# EAGLE schematic u-aizu_pir (EAGLE 8.2.2)
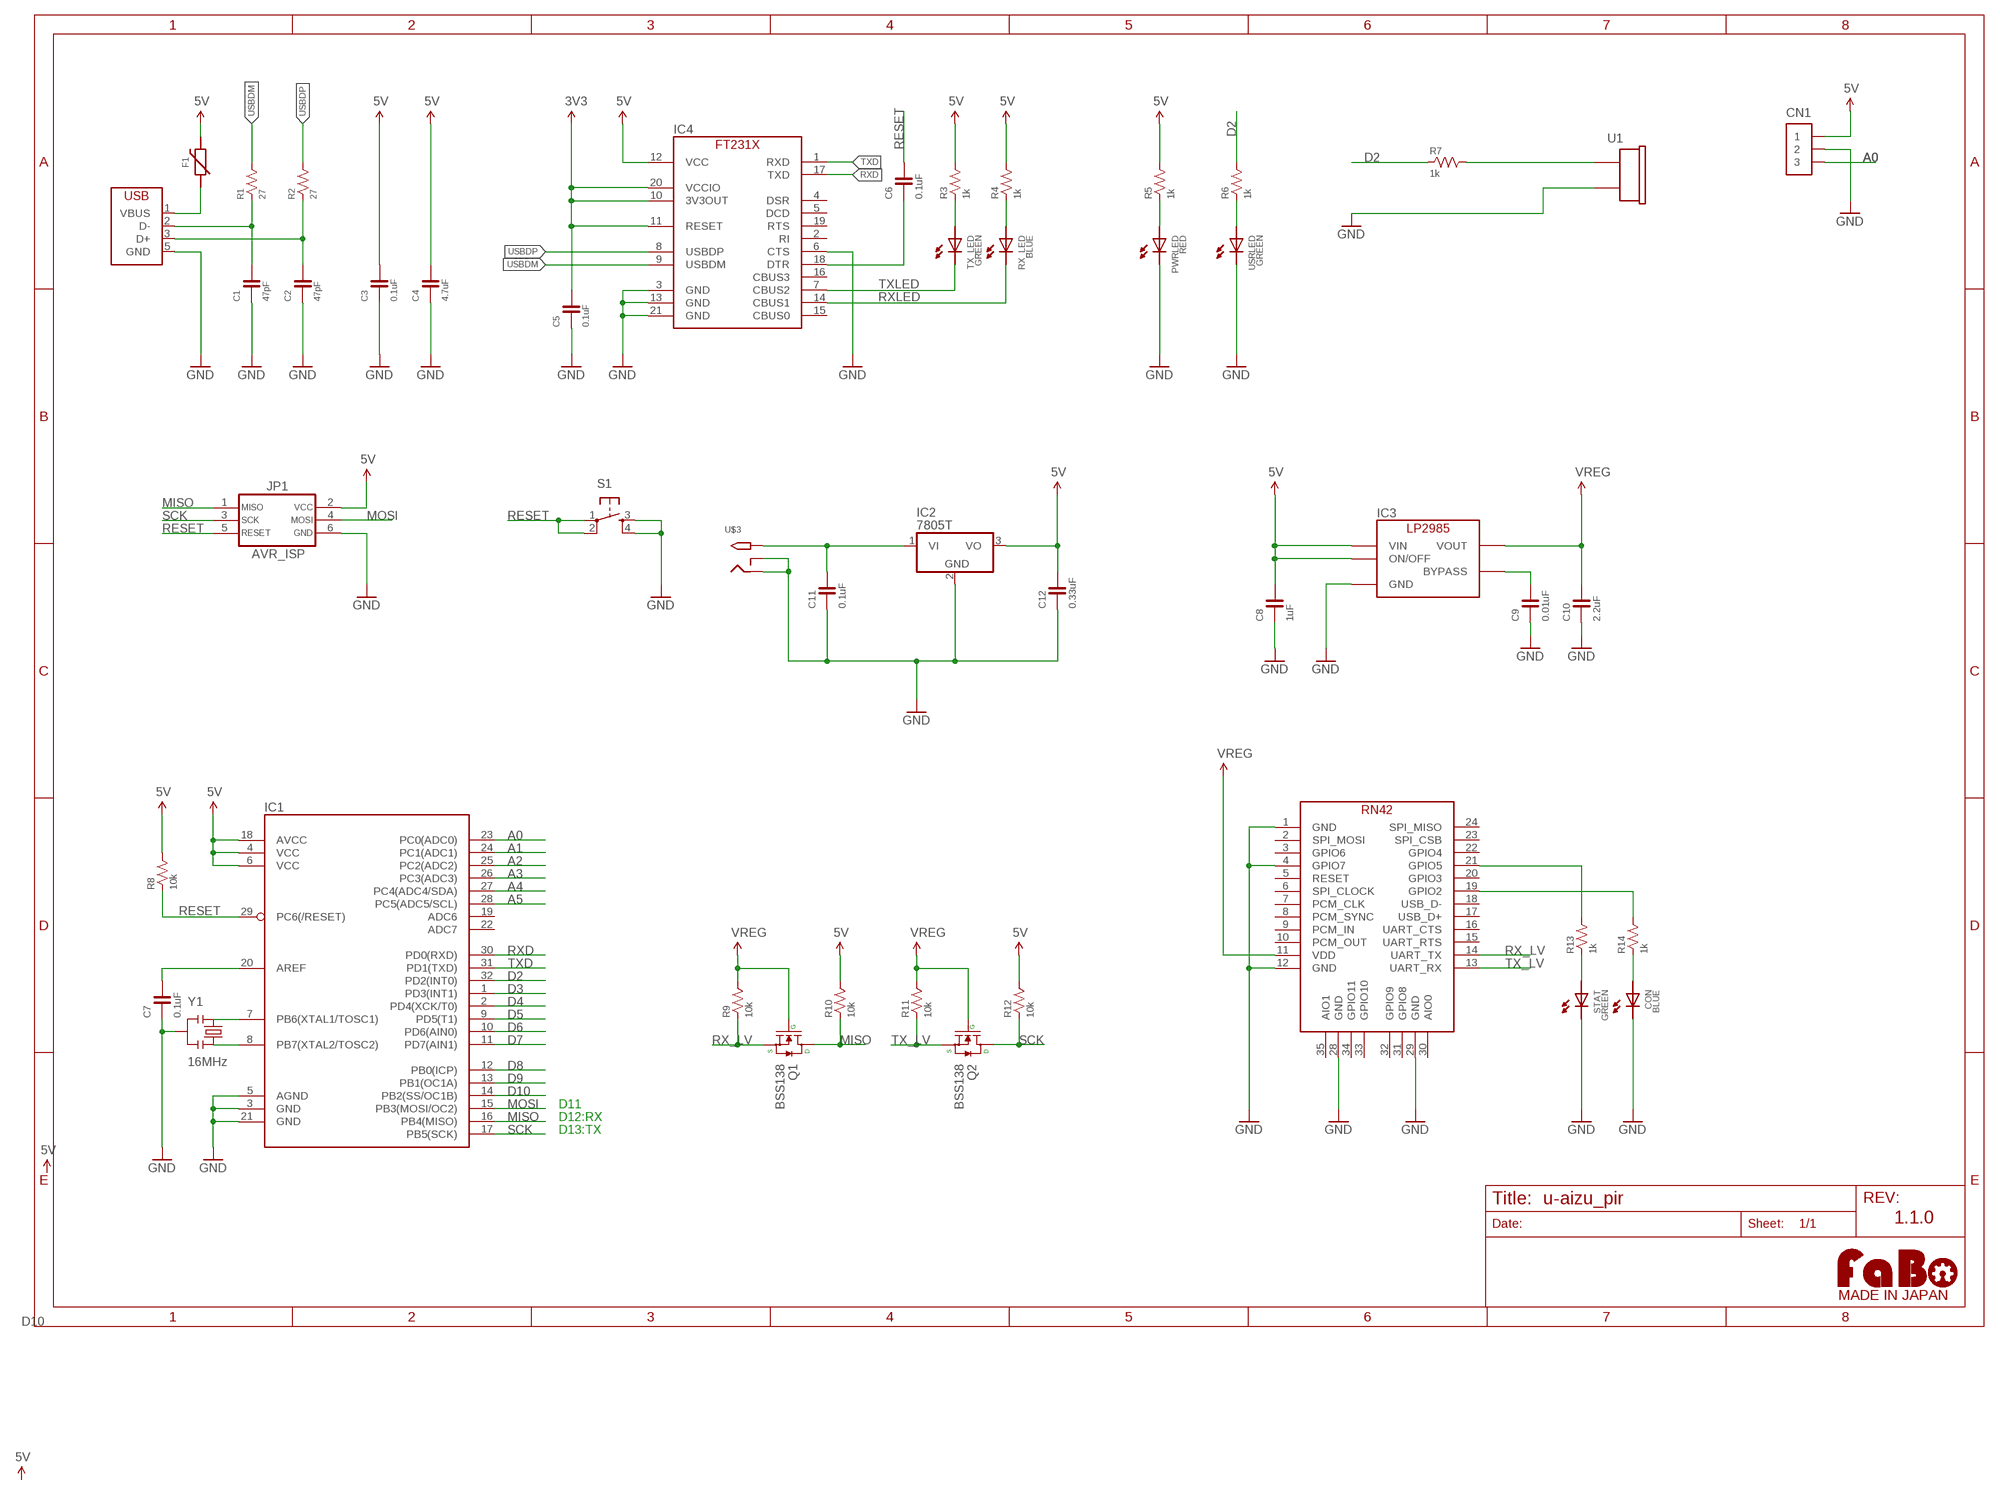
[diagram p0: schematic, sheet 1]

## Parts
C1  47pF  CAPACITOR-0603  [EIA0603]
C2  47pF  CAPACITOR-0603  [EIA0603]
C3  0.1uF  CAPACITOR-0603  [EIA0603]
C4  4.7uF  CAPACITOR-0603  [EIA0603]
C5  0.1uF  CAPACITOR-0603  [EIA0603]
C6  0.1uF  CAPACITOR-0603  [0603]
C7  0.1uF  CAPACITOR-0603  [0603]
C8  1uF  CAPACITOR-0603  [0603]
C9  0.01uF  CAPACITOR-0603  [0603]
C10  2.2uF  CAPACITOR-0603  [0603]
C11  0.1uF  CAPACITOR-0603  [0603]
C12  0.33uF  CAPACITOR-0603  [0603]
CN1  PIN_HEADER_1X3  [PIN_1X3]
CON  BLUE  LED-0603  [0603]
F1  FUSE-NANO  [NANOSMDC035F]
IC1  ATMEGA328P-AU  [TQFP-32]
IC2  7805T  [TO220H]
IC3  LP2985-33DBV  [SOT-23-5]
IC4  FT231XQ  [QFN-20_FT231X]
JP1  AVR_ISP  AVR_ISP-TC2030_NOHOLE  [TC2030]
PWRLED  RED  LED-0603  [0603]
Q1  BSS138  MOSFET-N  [SOT23-3]
Q2  BSS138  MOSFET-N  [SOT23-3]
R1  27  RESISTOR-0603  [EIA0603]
R2  27  RESISTOR-0603  [EIA0603]
R3  1k  RESISTOR-0603  [0603]
R4  1k  RESISTOR-0603  [0603]
R5  1k  RESISTOR-0603  [0603]
R6  1k  RESISTOR-0603  [0603]
R7  1k  RESISTOR-AXL-REGULAR  [AXL-REGULAR]
R8  10k  RESISTOR-0603  [0603]
R9  10k  RESISTOR-0603  [0603]
R10  10k  RESISTOR-0603  [0603]
R11  10k  RESISTOR-0603  [0603]
R12  10k  RESISTOR-0603  [0603]
R13  1k  RESISTOR-0603  [0603]
R14  1k  RESISTOR-0603  [0603]
RX_LED  BLUE  LED-0603  [0603]
S1  TACT-SWITCH-SMD_KMR2  [KMR2]
STAT  GREEN  LED-0603  [0603]
TX_LED  GREEN  LED-0603  [0603]
U1  BUZZER  [PKM13EPYH4000-A0]
U$2  LOGO_FABO-S_BOTTOM  [LOGO_FABO_S_BOTTOM]
U$3  2.1MMJACKTHM  [PJ-102A]
U$4  MICROCHIP-RN42  [MICROCHIP-RN42]
USB1  USB-MICRO_B_SMT_HIROSE  [ZX62R-B-5P]
USRLED  GREEN  LED-0603  [0603]
Y1  16MHz  RESONATOR-CSTCE_V  [CSTCE_V]

## Nets
3V3: C5.2 IC4.10(3V3OUT) IC4.11(RESET) IC4.20(VCCIO)
5V: C3.2 C4.2 C8.2 C12.2 CN1.1 F1.2 IC1.4(VCC) IC1.6(VCC) IC1.18(AVCC) IC2.3(VO) IC3.1(VIN) IC3.3(ON/OFF) IC4.12(VCC) JP1.2 R3.2 R4.2 R5.2 R8.2 R10.2 R12.2
A0: CN1.3 IC1.23(PC0(ADC0))
A1: IC1.24(PC1(ADC1))
A2: IC1.25(PC2(ADC2))
A3: IC1.26(PC3(ADC3))
A4: IC1.27(PC4(ADC4/SDA))
A5: IC1.28(PC5(ADC5/SCL))
D2: IC1.32(PD2(INT0)) R6.2 R7.1
D3: IC1.1(PD3(INT1))
D4: IC1.2(PD4(XCK/T0))
D5: IC1.9(PD5(T1))
D6: IC1.10(PD6(AIN0))
D7: IC1.11(PD7(AIN1))
D8: IC1.12(PB0(ICP))
D9: IC1.13(PB1(OC1A))
D10: IC1.14(PB2(SS/OC1B))
DM: C2.2 R2.1 USB1.3(D+)
DP: C1.2 R1.1 USB1.2(D-)
DTR: C6.1 IC4.18(DTR)
GND: C1.1 C2.1 C3.1 C4.1 C5.1 C7.1 C8.1 C9.1 C10.1 C12.1 CN1.2 CON.CATHODE IC1.3(GND) IC1.5(AGND) IC1.21(GND) IC2.2(GND) IC3.2(GND) IC4.3(GND) IC4.6(CTS) IC4.13(GND) IC4.21(GND) JP1.6 PWRLED.CATHODE S1.3 S1.4 STAT.CATHODE U$3.RING U$3.RING_SW U$4.1(GND) U$4.4(GPIO7) U$4.12(GND) U$4.28(GND) U$4.29(GND) USB1.5(GND) USRLED.CATHODE Y1.2
GND1: U1.2
MISO: IC1.16(PB4(MISO)) JP1.1 Q1.3(D) R10.1
MOSI: IC1.15(PB3(MOSI/OC2)) JP1.4
N$1: R3.1 TX_LED.ANODE
N$2: C7.2 IC1.20(AREF)
N$3: IC1.8(PB7(XTAL2/TOSC2)) Y1.3
N$4: IC1.7(PB6(XTAL1/TOSC1)) Y1.1
N$5: C9.2 IC3.4(BYPASS)
N$6: F1.1 USB1.1(VBUS)
N$7: R4.1 RX_LED.ANODE
N$8: R13.2 U$4.21(GPIO5)
N$9: R14.2 U$4.19(GPIO2)
N$10: R13.1 STAT.ANODE
N$11: CON.ANODE R14.1
N$13: PWRLED.ANODE R5.1
N$14: R7.2 U1.1
N$15: R6.1 USRLED.ANODE
N$32: IC2.1(VI) U$3.TIP
RESET: C6.2 IC1.29(PC6(/RESET)) JP1.5 R8.1 S1.1 S1.2
RX_LV: Q1.2(S) R9.1 U$4.14(UART_TX)
RXD: IC1.30(PD0(RXD)) IC4.17(TXD)
RXLED: IC4.14(CBUS1) RX_LED.CATHODE
SCK: IC1.17(PB5(SCK)) JP1.3 Q2.3(D) R12.1
TX_LV: Q2.2(S) R11.1 U$4.13(UART_RX)
TXD: IC1.31(PD1(TXD)) IC4.1(RXD)
TXLED: IC4.7(CBUS2) TX_LED.CATHODE
USBDM: IC4.9(USBDM) R1.2
USBDP: IC4.8(USBDP) R2.2
VREG: C10.2 IC3.5(VOUT) Q1.1(G) Q2.1(G) R9.2 R11.2 U$4.11(VDD)
Unconnected: C11.1 C11.2 IC1.19(ADC6) IC1.22(ADC7) IC4.2(RI) IC4.4(DSR) IC4.5(DCD) IC4.15(CBUS0) IC4.16(CBUS3) IC4.19(RTS) U$4.2(SPI_MOSI) U$4.3(GPIO6) U$4.5(RESET) U$4.6(SPI_CLOCK) U$4.7(PCM_CLK) U$4.8(PCM_SYNC) U$4.9(PCM_IN) U$4.10(PCM_OUT) U$4.15(UART_RTS) U$4.16(UART_CTS) U$4.17(USB_D+) U$4.18(USB_D-) U$4.20(GPIO3) U$4.22(GPIO4) U$4.23(SPI_CSB) U$4.24(SPI_MISO) U$4.30(AIO0) U$4.31(GPIO8) U$4.32(GPIO9) U$4.33(GPIO10) U$4.34(GPIO11) U$4.35(AIO1)

## Notes on the sheet
- D11
- D12:RX
- D13:TX
- 1.1.0

## Library data of the parts
C1-C5 = u-aizu:CAPACITOR
C6-C12 = FaBo-Capacitor:CAPACITOR: CAPACITOR
CN1 = FaBo-PIN:PIN_HEADER_1X3
CON PWRLED RX_LED STAT TX_LED USRLED = FaBo-LED:LED
F1 = u-aizu:FUSE
IC1 = FaBo-MPU:ATMEGA328
IC2 = adafruit:78*: Positive VOLTAGE REGULATOR Added bigger pads to the TO-92 package
IC3 = FaBo-Supply:LP2985: LP2985
IC4 = u-aizu:FT231X
JP1 = FaBo-PIN:AVR_ISP
Q1 Q2 = FaBo-etc:MOSFET-N
R1 R2 = u-aizu:RESISTOR
R3-R14 = FaBo-Resistors:RESISTOR: RESISTOR
S1 = FaBo-Switch:TACT-SWITCH
U1 = FaBo-Parts:BUZZER
U$2 = FaBo-Logo:LOGO_FABO
U$3 = adafruit:2.1MMJACK: 2.1mm x 5.5mm THM DC jack with internal switch. Digikey part #PJ-102A, 4UCON part #05537 2.1mm x 5.5mm SMT DC jack with internal switch. Digikey part #PJ-002A-SMT, 4UCON part #03267 By microbuilder.eu & adafruit.com
U$4 = FaBo-BT:MICROCHIP-RN42
USB1 = u-aizu:USB
Y1 = FaBo-etc:RESONATOR: RESONATOR